# EAGLE schematic a2401-diode-distortion (EAGLE 7.5.0)
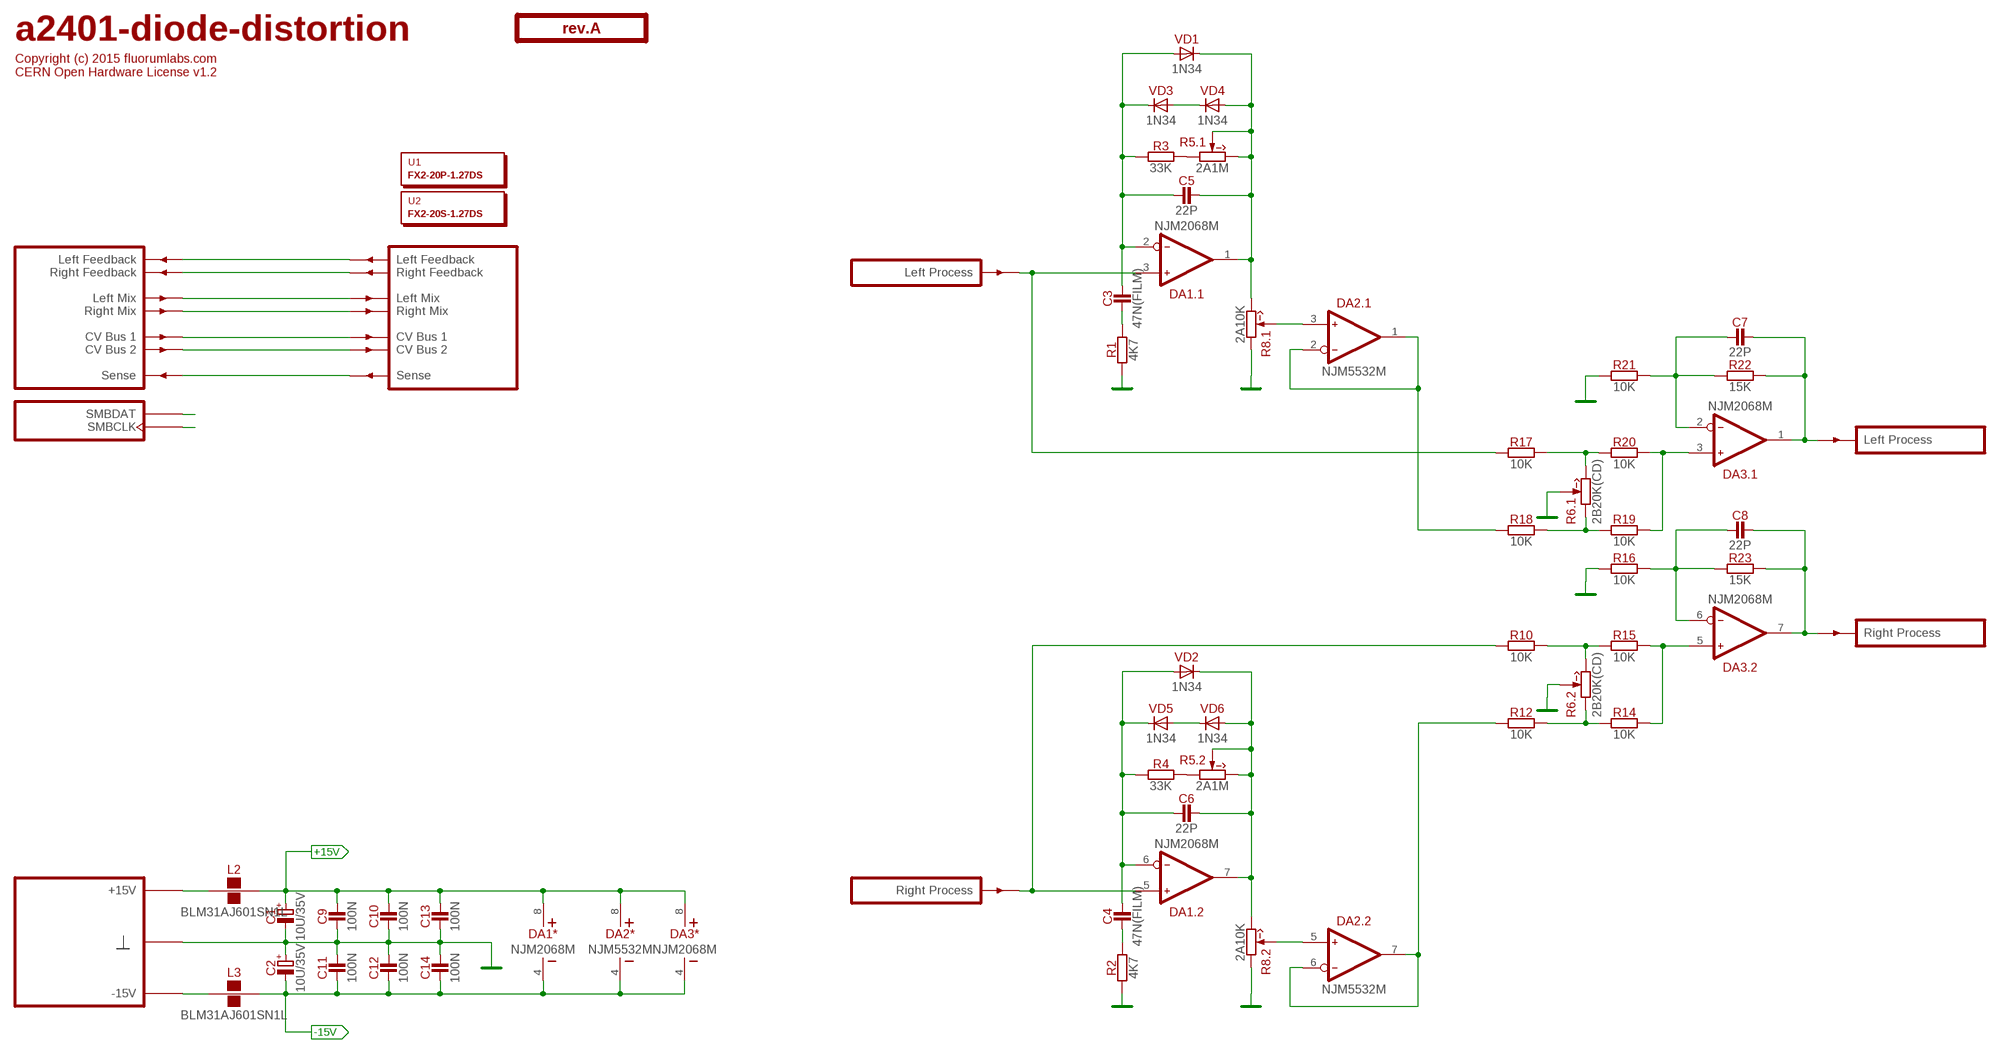
[diagram p0: schematic, sheet 1]

## Parts
C1  10U/35V  [E2-5]
C2  10U/35V  [E2-5]
C3  47N(FILM)  [C050-025X075]
C4  47N(FILM)  [C050-025X075]
C5  22P  [C-0805]
C6  22P  [C-0805]
C7  22P  [C-0805]
C8  22P  [C-0805]
C9  100N  [C-0805]
C10  100N  [C-0805]
C11  100N  [C-0805]
C12  100N  [C-0805]
C13  100N  [C-0805]
C14  100N  [C-0805]
DA1  NJM2068M  [SO-8]
DA2  NJM5532M  [SO-8]
DA3  NJM2068M  [SO-8]
L2  BLM31AJ601SN1L  [1206]
L3  BLM31AJ601SN1L  [1206]
O1  TITLE  [EMPTY]
PCB1  rev.A  ST2-BOARD-50  [ST2-BOARD-50]
R1  4K7  [R-0805]
R2  4K7  [R-0805]
R3  33K  [R-0805]
R4  33K  [R-0805]
R5  2A1M  [RV11-DUAL]
R6  2B20K(CD)  [RV11-DUAL]
R8  2A10K  [RV11-DUAL]
R10  10K  [R-0805]
R12  10K  [R-0805]
R14  10K  [R-0805]
R15  10K  [R-0805]
R16  10K  [R-0805]
R17  10K  [R-0805]
R18  10K  [R-0805]
R19  10K  [R-0805]
R20  10K  [R-0805]
R21  10K  [R-0805]
R22  15K  [R-0805]
R23  15K  [R-0805]
U1  FX2-20P-1.27DS  [EMPTY]
U2  FX2-20S-1.27DS  [EMPTY]
VD1  1N34  [DO35-15]
VD2  1N34  [DO35-15]
VD3  1N34  [DO35-15]
VD4  1N34  [DO35-15]
VD5  1N34  [DO35-15]
VD6  1N34  [DO35-15]

## Nets
+15V [power]: C1.+ C9.2 C10.2 C13.2 DA1.8(*:V+) DA2.8(*:V+) DA3.8(*:V+) L2.2
-15V [power]: C2.- C11.1 C12.1 C14.1 DA1.4(*:V-) DA2.4(*:V-) DA3.4(*:V-) L3.2
FBK_LEFT: PCB1.ALFBK'(LFBK') PCB1.ALFBK(LFBK)
FBK_RIGHT: PCB1.ARFBK'(RFBK') PCB1.ARFBK(RFBK)
GND: C1.- C2.+ C9.1 C10.1 C11.2 C12.2 C13.1 C14.2 PCB1.B4'(GND) PCB1.B4(GND) PCB1.B5'(GND) PCB1.B5(GND) PCB1.B6'(GND) PCB1.B6(GND) PCB1.B7'(GND) PCB1.B7(GND) PCB1.B8'(GND) PCB1.B8(GND) R1.1 R2.1 R6.2'(.2:W) R6.2(.1:W) R8.1'(.2:CCW) R8.1(.1:CCW) R16.1 R21.1
LMIX: PCB1.ALMIX'(LMIX') PCB1.ALMIX(LMIX)
N$1: R3.2 R5.1(.1:CCW)
N$2: R4.2 R5.1'(.2:CCW)
N$3: C7.2 DA3.1(.1:OUT) PCB1.BOUTL'(OUTL) R22.2
N$4: C3.1 R1.2
N$5: R6.3(.1:CW) R17.2 R20.1
N$6: DA1.5(.2:IN+) PCB1.BINR(INR) R10.1
N$7: C6.2 DA1.7(.2:OUT) R5.2'(.2:W) R5.3'(.2:CW) R8.3'(.2:CW) VD2.C VD6.A
N$8: C4.1 R2.2
N$9: C5.2 DA1.1(.1:OUT) R5.2(.1:W) R5.3(.1:CW) R8.3(.1:CW) VD1.C VD4.A
N$10: C4.2 C6.1 DA1.6(.2:IN-) R4.1 VD2.A VD5.C
N$11: C8.1 DA3.6(.2:IN-) R16.2 R23.1
N$12: DA3.5(.2:IN+) R14.2 R15.2
N$13: DA3.3(.1:IN+) R19.2 R20.2
N$14: VD3.A VD4.C
N$15: R6.1'(.2:CCW) R12.2 R14.1
N$16: PCB1.BSENSE'(SENSE') PCB1.BSENSE(SENSE)
N$17: C3.2 C5.1 DA1.2(.1:IN-) R3.1 VD1.A VD3.C
N$18: DA1.3(.1:IN+) PCB1.BINL(INL) R17.1
N$19: C8.2 DA3.7(.2:OUT) PCB1.BOUTR'(OUTR) R23.2
N$20: VD5.A VD6.C
N$23: DA2.5(.2:IN+) R8.2'(.2:W)
N$24: DA2.6(.2:IN-) DA2.7(.2:OUT) R12.1
N$26: DA2.3(.1:IN+) R8.2(.1:W)
N$27: DA2.1(.1:OUT) DA2.2(.1:IN-) R18.1
N$36: L3.1 PCB1.A-15'(P-15V) PCB1.A-15(P-15V) PCB1.B-15'(P-15V) PCB1.B-15(P-15V)
N$38: PCB1.ASMBDAT'(SMBDAT) PCB1.ASMBDAT(SMBDAT)
N$41: PCB1.ACV1'(CV1') PCB1.ACV1(CV1)
N$42: PCB1.ACV2'(CV2') PCB1.ACV2(CV2)
N$43: PCB1.ASMBCLK'(SMBCLK) PCB1.ASMBCLK(SMBCLK)
N$50: R6.1(.1:CCW) R18.2 R19.1
N$59: R6.3'(.2:CW) R10.2 R15.1
N$64: C7.1 DA3.2(.1:IN-) R21.2 R22.1
P+15V: L2.1 PCB1.A+15'(P+15V) PCB1.A+15(P+15V) PCB1.B+15'(P+15V) PCB1.B+15(P+15V)
RMIX: PCB1.ARMIX'(RMIX') PCB1.ARMIX(RMIX)

## Library data of the parts
C1 C2 = capacitors-electrolytic:?; MOUSER: 647-USW1V100MDD
C3 C4 = capacitors:?; MOUSER: 871-B32529C1473J
C5-C8 = capacitors:?; MOUSER: 77-VJ0805A220GXACBC
C9-C14 = capacitors:?; MOUSER: 77-VJ0805V104MXBPBC
DA1 DA3 = ic-jrc:NJM2068; MOUSER: 513-NJM2068M
DA2 = ic-jrc:NJM5532; MOUSER: 513-NJM5532M
L2 L3 = inductors:BLM31AJ601SN1L; MOUSER: 81-BLM31AJ601SN1L
O1 = text:TITLE
PCB1 = module-footprints:ST2-BOARD-50
R1 R2 = resistors:?; MOUSER: 660-RK73H2ATTD4701F
R3 R4 = resistors:?; MOUSER: 660-RK73H2ATTD3302F
R5 = potentiometers:2**?; MOUSER: 317-2102F-1M
R6 = potentiometers:2**?; MOUSER: 688-RK12L1230C1M
R8 = potentiometers:2**?; MOUSER: 688-RK12L12C0A0E
R10 R12 R14-R21 = resistors:?; MOUSER: 660-RK73H2ATTD1002F
R22 R23 = resistors:?; MOUSER: 660-RK73H2ATTD1502F
U1 = hardware:?; MOUSER: 798-FX2-20P-1.27DS71
U2 = hardware:?; MOUSER: 798-FX2-20S-1.27DS71
VD1-VD6 = diodes:?